# EAGLE design ESP07_TempSensor (EAGLE 6.6.0)
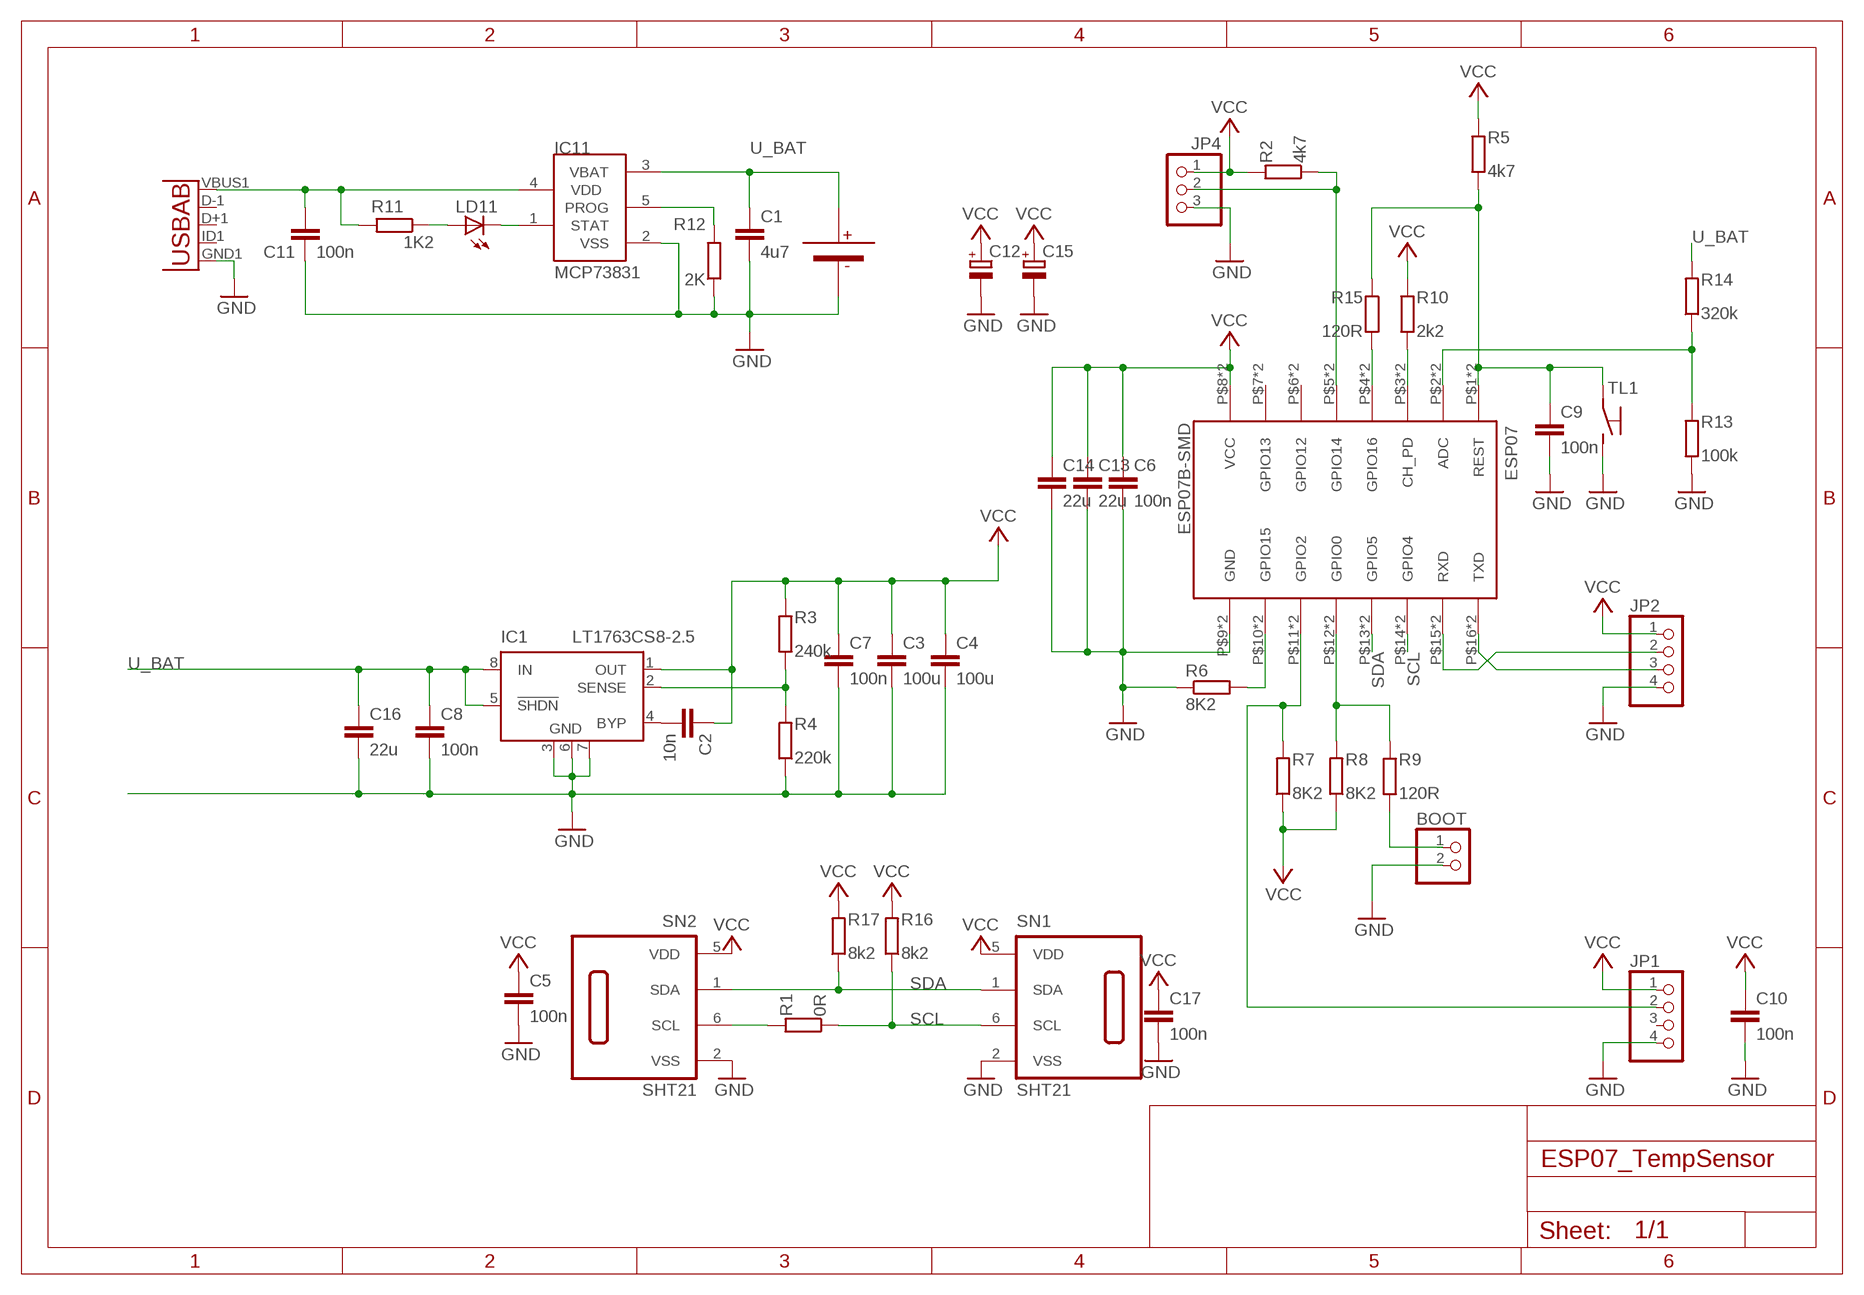
[diagram p0: schematic, sheet 1]

## Parts
BOOT  PINHD-1X2  [1X02]
C1  4u7  C-EUC0805  [C0805]
C2  10n  C-EUC0805  [C0805]
C3  100u  C-EUC1206  [C1206]
C4  100u  C-EUC1206  [C1206]
C5  100n  C-EUC0805  [C0805]
C6  100n  C-EUC0805  [C0805]
C7  100n  C-EUC1206  [C1206]
C8  100n  C-EUC0805  [C0805]
C9  100n  C-EUC0805  [C0805]
C10  100n  C-EUC0805  [C0805]
C11  100n  C-EUC0805  [C0805]
C12  CPOL-EUSMCC  [SMC_C]
C13  22u  C-EUC0805  [C0805]
C14  22u  C-EUC0805  [C0805]
C15  CPOL-EUSMCC  [SMC_C]
C16  22u  C-EUC0805  [C0805]
C17  100n  C-EUC0805  [C0805]
ESP07  ESP07B-SMD  [ESP07]
IC1  LT1763CS8-2.5  [SOIC8]
IC11  MCP73831  [SOT23-5L]
JP1  PINHD-1X4  [1X04]
JP2  PINHD-1X4  [1X04]
JP4  PINHD-1X3  [1X03]
LD11  LEDCHIPLED_0805  [CHIPLED_0805]
R1  0R  R-EU_M0805  [M0805]
R2  4k7  R-EU_M0805  [M0805]
R3  240k  R-EU_M0805  [M0805]
R4  220k  R-EU_M0805  [M0805]
R5  4k7  R-EU_M0805  [M0805]
R6  8K2  R-EU_M0805  [M0805]
R7  8K2  R-EU_M0805  [M0805]
R8  8K2  R-EU_M0805  [M0805]
R9  120R  R-EU_M0805  [M0805]
R10  2k2  R-EU_M0805  [M0805]
R11  1K2  R-EU_M0805  [M0805]
R12  2K  R-EU_M0805  [M0805]
R13  100k  R-EU_M0805  [M0805]
R14  320k  R-EU_M0805  [M0805]
R15  120R  R-EU_M0805  [M0805]
R16  8k2  R-EU_M0805  [M0805]
R17  8k2  R-EU_M0805  [M0805]
SN1  SHT21  [DFN6/SHT]
SN2  SHT21  [DFN6/SHT]
TL1  TS1107GS  [TS1107GS]
U1  USB""  [USB-MICRO-SMD]
U$2  18650_CLIPS  [CLIPS_18650]

## Nets
FB: IC1.2(SENSE) R3.1 R4.2
GND: BOOT.2 C1.2 C3.2 C4.2 C5.2 C6.2 C7.2 C8.2 C9.2 C10.2 C11.1 C12.- C13.2 C14.2 C15.- C16.2 C17.2 ESP07.P9(GND) ESP07.P$9(GND) IC1.3(GND) IC1.6(GND) IC1.7(GND) IC11.2(VSS) JP1.4 JP2.4 JP4.3 R4.1 R6.1 R12.1 R13.1 SN1.2(VSS) SN2.2(VSS) TL1.P$2(S) U1.GND1(GND) U$2.P$3 U$2.P$4
N$1: C2.2 IC1.4(BYP)
N$2: IC11.1(STAT) LD11.C
N$3: ESP07.P5(GPIO14) ESP07.P$5(GPIO14) JP4.2 R2.1
N$4: LD11.A R11.1
N$5: ESP07.P10(GPIO15) ESP07.P$10(GPIO15) R6.2
N$6: R1.2 SN2.6(SCL)
N$8: ESP07.P12(GPIO0) ESP07.P$12(GPIO0) R8.2 R9.1
N$9: IC11.5(PROG) R12.2
N$10: ESP07.P3(CH_PD) ESP07.P$3(CH_PD) R10.1
N$12: BOOT.1 R9.2
N$16: ESP07.P2(ADC) ESP07.P$2(ADC) R13.2 R14.1
N$20: ESP07.P4(GPIO16) ESP07.P$4(GPIO16) R15.2
N$21: C9.1 ESP07.P1(REST) ESP07.P$1(REST) R5.1 R15.1 TL1.P$1(P)
RXD: ESP07.P15(RXD) ESP07.P$15(RXD) JP2.2
SCL: ESP07.P14(GPIO4) ESP07.P$14(GPIO4) R1.1 R16.1 SN1.6(SCL)
SDA: ESP07.P13(GPIO5) ESP07.P$13(GPIO5) R17.1 SN1.1(SDA) SN2.1(SDA)
TMP_DATA: ESP07.P11(GPIO2) ESP07.P$11(GPIO2) JP1.2 R7.2
TXD: ESP07.P16(TXD) ESP07.P$16(TXD) JP2.3
U_BAT: C1.1 C8.1 C16.1 IC1.5(!SHDN) IC1.8(IN) IC11.3(VBAT) R14.2 U$2.P$1 U$2.P$2
U_CHRG: C11.2 IC11.4(VDD) R11.2 U1.VBUS1(VBUS)
VCC: C2.1 C3.1 C4.1 C5.1 C6.1 C7.1 C10.1 C12.+ C13.1 C14.1 C15.+ C17.1 ESP07.P8(VCC) ESP07.P$8(VCC) IC1.1(OUT) JP1.1 JP2.1 JP4.1 R2.2 R3.2 R5.2 R7.1 R8.1 R10.2 R16.2 R17.2 SN1.5(VDD) SN2.5(VDD)
Unconnected: ESP07.P6(GPIO12) ESP07.P7(GPIO13) ESP07.P$6(GPIO12) ESP07.P$7(GPIO13) JP1.3 U1.D+1(D+) U1.D-1(D-) U1.ID1(USBID)

## Library data of the parts
BOOT = pinhead:PINHD-1X2: PIN HEADER
C1 C2 C5 C6 C8-C11 C13 C14 C16 C17 = rcl:C-EU: CAPACITOR, European symbol
C3 C4 C7 = rcl:C-EU: CAPACITOR, European symbol; TME: GRM31CR60J107ME39L
C12 C15 = rcl:CPOL-EU: POLARIZED CAPACITOR, European symbol
ESP07 = NicShackle:ESP07
IC1 = linear-technology:LT1763CS8: 500mA, Low Noise, LDO Micropower Regulators Source: http://cds.linear.com/docs/Datasheet/1763ff.pdf; MPN: LT1763CS8-2.5; OC_FARNELL: 1273616; OC_NEWARK: 57M6051
IC11 = microchip-update-2:MCP73831: Miniature Single-Cell, Fully Integrated Li-Ion, Li-Polymer Charge Management Controllers
JP1 JP2 = pinhead:PINHD-1X4: PIN HEADER
JP4 = pinhead:PINHD-1X3: PIN HEADER
LD11 = led:LED: LED OSRAM: - CHIPLED LG R971, LG N971, LY N971, LG Q971, LY Q971, LO R971, LY R971 LH N974, LH R974 LS Q976, LO Q976, LY Q976 LO Q996 - Hyper CHIPLED LW Q18S LB Q993, LB Q99A, LB R99A - SideLED LS A670, LO A670, LY A670, LG A670, LP A670 LB A673, LV A673, LT A673, LW A673 LH A674 LY A675 LS A676, LA A676, LO A676, LY A676, LW A676 LS A679, LY A679, LG A679 - Hyper Micro SIDELED® LS Y876, LA Y876, LO Y876, LY Y876 LT Y87S - SmartLED LW L88C, LW L88S LB L89C, LB L89S, LG L890 LS L89K, LO L89K, LY L89K LS L896, LA L896, LO L896, LY L896 - TOPLED LS T670, LO T670, LY T670, LG T670, LP T670 LSG T670, LSP T670, LSY T670, LOP T670, LYG T670 LG T671, LOG T671, LSG T671 LB T673, LV T673, LT T673, LW T673 LH T674 LS T676, LA T676, LO T676, LY T676, LB T676, LH T676, LSB T676, LW T676 LB T67C, LV T67C, LT T67C, LS T67K, LO T67K, LY T67K, LW E67C LS E67B, LA E67B, LO E67B, LY E67B, LB E67C, LV E67C, LT E67C LW T67C LS T679, LY T679, LG T679 LS T770, LO T770, LY T770, LG T770, LP T770 LB T773, LV T773, LT T773, LW T773 LH T774 LS E675, LA E675, LY E675, LS T675 LS T776, LA T776, LO T776, LY T776, LB T776 LHGB T686 LT T68C, LB T68C - Hyper Mini TOPLED® LB M676 - Mini TOPLED Santana® LG M470 LS M47K, LO M47K, LY M47K Source: http://www.osram.convergy.de LUXEON: - LUMILED® LXK2-PW12-R00, LXK2-PW12-S00, LXK2-PW14-U00, LXK2-PW14-V00 LXK2-PM12-R00, LXK2-PM12-S00, LXK2-PM14-U00 LXK2-PE12-Q00, LXK2-PE12-R00, LXK2-PE12-S00, LXK2-PE14-T00, LXK2-PE14-U00 LXK2-PB12-K00, LXK2-PB12-L00, LXK2-PB12-M00, LXK2-PB14-N00, LXK2-PB14-P00, LXK2-PB14-Q00 LXK2-PR12-L00, LXK2-PR12-M00, LXK2-PR14-Q00, LXK2-PR14-R00 LXK2-PD12-Q00, LXK2-PD12-R00, LXK2-PD12-S00 LXK2-PH12-R00, LXK2-PH12-S00 LXK2-PL12-P00, LXK2-PL12-Q00, LXK2-PL12-R00 Source: www.luxeon.com KINGBRIGHT: KA-3528ASYC Source: www.kingbright.com
R1-R17 = rcl:R-EU_: RESISTOR, European symbol
SN1 SN2 = sensirion:SHT21: Humidity and Temperature Sensor
TL1 = switchs:TS1107GS
U1 = MicroUSB:USB: This is a USB AB connector that is compatible with USB OTG. i.e. this connector can serve as a host or device
U$2 = Battery_Clips:18650_CLIPS

## Board
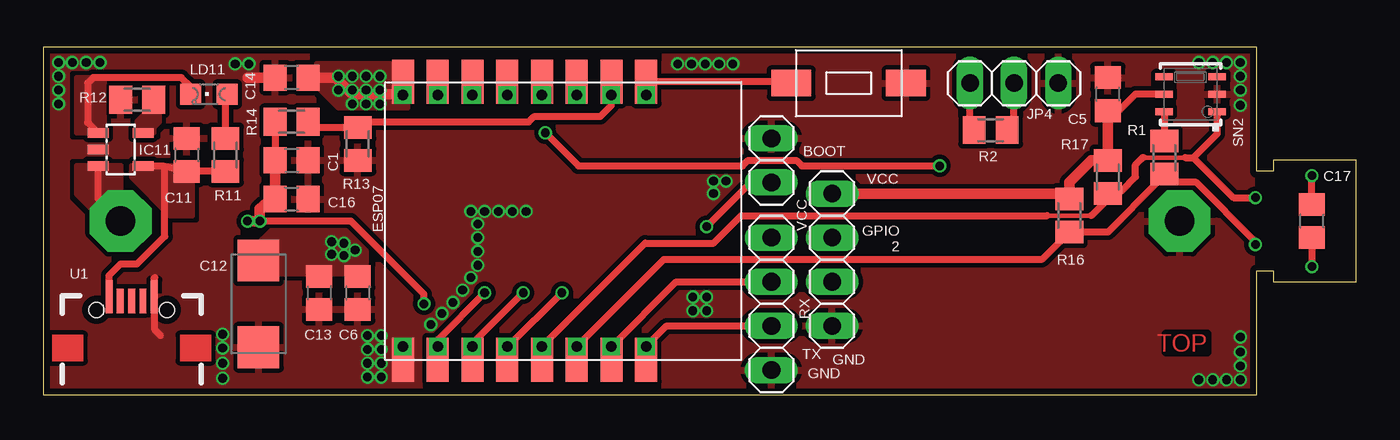
[diagram p1: board, top side]
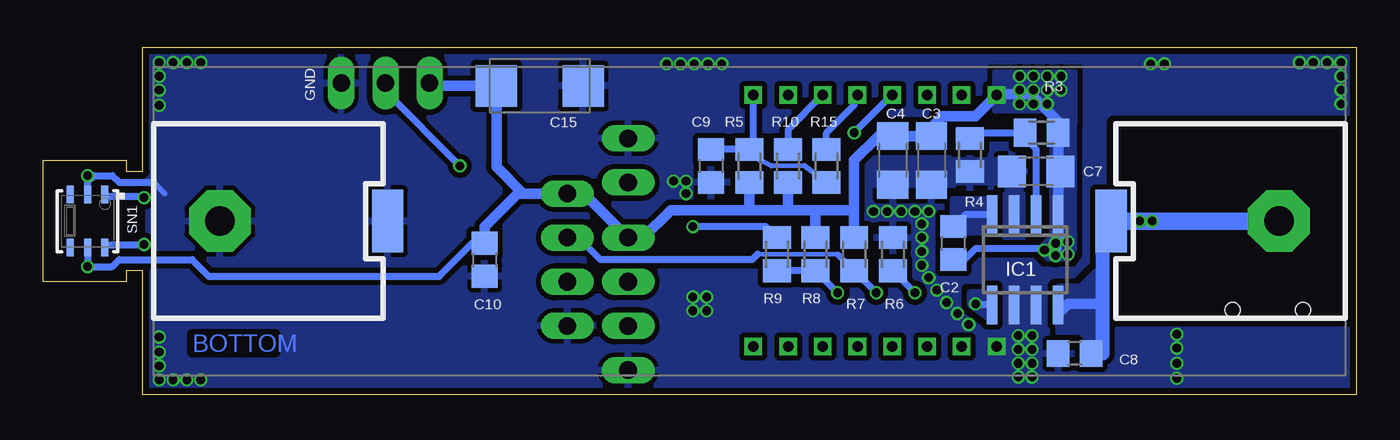
[diagram p2: board, bottom side, seen from below]

Size 75.56 x 19.99 mm. Coordinates in mm from the lower left corner, seen from the top.
Outline: 0,0 69.84,0 69.85,7.14 70.8,7.14 70.8,6.51 75.56,6.51 75.56,13.49 70.8,13.49 70.8,12.86 69.84,12.86 69.84,19.99 0,19.99 0,0
Copper layers (1*16): Top 0.035559375mm / dielectric 1.6mm / Bottom 0.035559375mm
Design rules "oshpark-2layer": minimum track width 6mil, minimum drill 10mil, track to track 6mil, track to pad 6mil, pad to pad 6mil, via to via 6mil, smd to smd 6mil, copper to edge 15mil, drill to drill 6mil, minimum pad ring 5mil, minimum via ring 5mil, stop-mask expansion 2.5mil, vias tented up to drill 0mil, thermal gap 10mil

### Footprints (pad centres in the part's own frame; a part is rotated, then mirrored left to right if it is on the bottom)
1X02 = drill 1.016 long: 1 -1.27,0; 2 1.27,0
C0805 = smd 1.3 x 1.5: 1 -0.95,0; 2 0.95,0
C1206 = smd 1.6 x 1.8: 1 -1.4,0; 2 1.4,0
SMC_C = smd 2.4 x 2.4: + -2.5,0; - 2.5,0
ESP07 = smd 2.54 x 1.27: P1 -8.028,8.027; P2 -8.028,6.027; P3 -8.028,4.027; P4 -8.028,2.027; P5 -8.028,0.027; P6 -8.028,-1.973; P7 -8.028,-3.973; P8 -8.028,-5.973; P9 7.972,-5.973; P10 7.972,-3.973; P11 7.972,-1.973; P12 7.972,0.027; P13 7.972,2.027; P14 7.972,4.027; P15 7.972,6.027; P16 7.972,8.027 | drill 0.6 pad 1.016 square: P$1 -7.264,8.026; P$2 -7.264,6.02; P$3 -7.264,4.039; P$4 -7.264,2.032; P$5 -7.264,0.025; P$6 -7.264,-1.981; P$7 -7.264,-3.962; P$8 -7.264,-5.969; P$9 7.214,-5.969; P$10 7.214,-3.962; P$11 7.214,-1.981; P$12 7.214,0.025; P$13 7.214,2.032; P$14 7.214,4.039; P$15 7.214,6.02; P$16 7.214,8.026
SOIC8 = smd 0.6 x 2.2: 1 -1.905,-2.6; 2 -0.635,-2.6; 3 0.635,-2.6; 4 1.905,-2.6; 5 1.905,2.6; 6 0.635,2.6; 7 -0.635,2.6; 8 -1.905,2.6
SOT23-5L = smd 0.55 x 1.2: 1 -0.95,-1.3; 2 0,-1.3; 3 0.95,-1.3; 4 0.95,1.3; 5 -0.95,1.3
1X04 = drill 1.016 long: 1 -3.81,0; 2 -1.27,0; 3 1.27,0; 4 3.81,0
1X03 = drill 1.016 long: 1 -2.54,0; 2 0,0; 3 2.54,0
CHIPLED_0805 = smd 1.2 x 1.2: A 0,-1.05; C 0,1.05
M0805 = smd 1.3 x 1.6: 1 -0.95,0; 2 0.95,0
DFN6/SHT = smd 0.4 x 1: 1 -1,-1.527; 2 0,-1.527; 3 1,-1.527; 4 1,1.527; 5 0,1.527; 6 -1,1.527
TS1107GS = smd 2.286 x 1.524: P$1 -3.302,0; P$2 3.302,0
USB-MICRO-SMD = smd 1.4 x 0.4: D+1 2.7,0; D-1 2.7,0.65; ID1 2.7,-0.65 | smd 1.908 x 0.4: GND1 2.954,-1.3; VBUS1 2.954,1.3 | hole 0.85: 2.2,2.027; 2.2,-2.027
CLIPS_18650 = drill 1.7 pad 3.556 octagon: P$1 0,0; P$3 60.96,0 | smd 1.8 x 3.6: P$2 9.652,0; P$4 51.308,0

### Placement (x,y rotation side)
BOOT  41.91,13.49 90 top
C1  14.29,13.49 0 top
C2  23.18,8.73 90 bottom
C3  24.45,13.49 270 bottom
C4  26.67,13.49 270 bottom
C5  61.28,17.3 90 top
C6  18.1,5.87 270 top
C7  18.41,12.86 180 bottom
C8  16.19,2.38 180 bottom
C9  37.15,13.18 270 bottom
C10  50.16,7.78 270 bottom
C11  8.26,13.81 270 top
C12  12.38,5.24 270 top
C13  15.88,5.87 270 top
C14  14.29,18.26 180 top
C15  46.99,17.78 0 bottom
C16  14.29,11.27 0 top
C17  73.03,10 90 top
ESP07  26.67,10 270 top
IC1  19.05,7.78 180 bottom
IC11  4.45,14.13 270 top
JP1  45.4,7.78 270 top
JP2  41.91,5.24 270 top
JP4  55.88,17.94 0 top
LD11  9.53,17.3 90 top
R1  64.53,13.65 90 top
R2  54.53,15.24 180 top
R3  18.1,15.08 0 bottom
R4  22.23,13.81 90 bottom
R5  34.92,13.18 270 bottom
R6  26.67,8.1 270 bottom
R7  28.89,8.1 270 bottom
R8  31.11,8.1 270 bottom
R9  33.34,8.1 90 bottom
R10  32.7,13.18 270 bottom
R11  10.48,13.81 270 top
R12  5.4,16.99 0 top
R13  18.1,14.45 90 top
R14  14.29,15.72 180 top
R15  30.48,13.18 90 bottom
R16  59.05,10.32 90 top
R17  61.28,12.54 90 top
SN1  73.03,10 180 bottom
SN2  66.04,17.3 90 top
TL1  46.35,17.94 0 top
U1  5.08,2.7 90 top
U$2  4.45,10 180 bottom

### Tracks (layer width: path | path; a pad name or v marks a point on that pad's centre or on a via)
FB
  Bottom 0.406: R4.2 21.91,15.08 R3.1 19.05,14.76 18.41,14.13 IC1.2
GND  (via drill 0.5)
  Top 0.406: 6.75,3.41 6.38,3.78 U1.GND1 6.37,5.72 6.37,6.69 6.43,6.75 | C17.2 v73.03,12.62
  Top 0.61: C14.2 11.75,18.26
  Bottom 0.305: SN1.2 73.03,11.91 | 69.22,12.22 68.58,11.59
  Bottom 0.406: 73.03,11.91 v73.03,12.62 72.95,12.38 72.63,12.62 71.6,12.62 71.2,12.22 69.22,12.22
  other vias: 68.9,0.87 68.9,18.34 68.9,1.67 68.9,2.46 68.9,17.54 68.9,16.67 68.9,19.13 68.9,3.33 19.45,3.41 18.65,3.41 18.65,2.62 19.45,2.62 19.45,1.83 18.65,1.83 19.45,1.03 18.65,1.03 22.3,4.05 22.94,4.68 23.57,5.32 0.87,19.13 1.67,19.13 0.87,18.34 2.46,19.13 0.87,17.54 0.87,16.75 3.25,19.13 10.32,0.95 10.32,1.83 10.32,2.7 10.32,3.49 68.1,19.13 67.31,19.13 66.52,19.13 68.1,0.87 67.31,0.87 66.52,0.87 37.39,5.64 37.39,4.84 38.18,4.84 38.18,5.64 36.51,19.05 37.31,19.05 38.1,19.05 38.89,19.05 39.69,19.05 11.83,19.05 11.03,19.05 24.61,10.56 25.4,10.56 26.19,10.56 26.99,10.56 27.78,10.56 25,9.84 25,9.05 25,8.26 25,7.46 24.61,6.75 24.13,6.03 38.58,12.3 38.58,11.59 39.29,12.3
  pour Top (isolate 0.254, rank 6): 0.32,19.68 69.53,19.68 69.53,0.32 0.32,0.32
  pour Bottom (isolate 0.305, rank 6): 0.32,19.68 69.53,19.68 69.53,0.32 0.32,0.32
  pour Bottom (no thermals): 20,11.59 20,11.91 20.32,12.22 27.94,12.22 27.94,13.18 27.62,13.49 19.68,13.49 19.37,13.18 19.37,11.59
N$1
  Bottom 0.406: IC1.4 22.48,10.38 C2.2
  pour Bottom (no thermals): 21.27,9.37 23.18,9.37 23.18,11.27 21.27,11.27
N$2
  Top 0.406: LD11.C 8.47,17.72 7.94,18.26 2.86,18.26 2.54,17.94 2.54,15.68 IC11.1
  pour Top (no thermals): 3.49,15.08 3.49,18.26 1.91,18.26 1.91,15.08
N$3  (via drill 0.5)
  Top 0.406: v28.89,15.08 30.8,13.18 40.24,13.18 40.56,13.49 43.34,13.49 43.66,13.18 v51.59,13.18 | ESP07.P5 ESP07.P$5 | R2.1 55.88,15.64 JP4.2
  Bottom 0.406: ESP07.P$5 v28.89,15.08 | v51.59,13.18 55.88,17.46 JP4.2
N$4
  Top 0.406: R11.1 10.48,17.08 LD11.A
N$5  (via drill 0.5)
  Top 0.406: v25.4,5.87 22.71,3.18 ESP07.P$10 22.7,2.78 ESP07.P10
  Bottom 0.406: v25.4,5.87 v25.4,5.88 R6.2
N$6
  Top 0.406: SN2.6 64.53,16.3 R1.2
N$8  (via drill 0.5)
  Top 0.406: ESP07.P12 ESP07.P$12 | ESP07.P$12 | ESP07.P$12 26.76,2.79 v29.84,5.87
  Bottom 0.406: v29.84,5.87 v29.84,5.88 R8.2 R9.1
N$9
  pour Top (no thermals): 5.4,15.08 5.4,15.72 6.03,16.35 6.67,16.35 6.67,15.72 6.35,15.4 6.35,15.08
N$10
  Top 0.406: ESP07.P3 30.71,18.02 ESP07.P$3
  Bottom 0.406: ESP07.P$3 32.7,15.27 R10.1
N$12  (via drill 0.5)
  Top 0.406: v38.18,9.68 40.72,12.22 BOOT.1
  Bottom 0.406: R9.2 33.98,9.68 v38.18,9.68
N$16
  Top 0.406: R14.1 15.56,15.4 R13.2 18.42,15.72 27.94,15.72 28.26,16.03 32.07,16.03 32.69,16.66 ESP07.P$2 ESP07.P2
N$20
  Top 0.406: ESP07.P4 ESP07.P$4
  Bottom 0.406: R15.2 30.48,15.08 28.89,16.67 28.89,17.07 ESP07.P$4
N$21
  Top 0.406: ESP07.P$1 ESP07.P1 43.05,18.03 TL1.P$1
  Bottom 0.254: 33.66,13.18 31.75,13.18
  Bottom 0.305: 33.66,13.18 34.29,13.49 R5.1 | 31.75,13.18 R15.1
  Bottom 0.406: R5.1 35.01,14.36 | 35.01,14.36 34.7,14.67 ESP07.P$1 | 35.01,14.36 35.24,14.13 C9.1
RXD
  Top 0.406: ESP07.P15 ESP07.P$15 | ESP07.P$15 | ESP07.P$15 36.42,6.51 JP2.2
SCL  (via drill 0.5)
  Top 0.406: 64.14,12.22 66.36,12.22 69.77,8.81 v69.77,8.65 | ESP07.P14 30.7,2.78 ESP07.P$14 35.7,7.78 57.47,7.78 R16.1 61.28,9.37 64.14,12.22 | 64.14,12.22 64.14,12.31 R1.1
  Bottom 0.305: 69.82,8.6 v69.77,8.65
  Bottom 0.406: 69.82,8.6 71.9,8.6 SN1.6
SDA  (via drill 0.5)
  Top 0.254: 57.78,10.32 60.33,10.32 | 63.34,13.65 65.72,13.65
  Top 0.406: ESP07.P$13 34.65,8.73 38.58,8.73 40.16,10.32 57.78,10.32 | 60.33,10.32 61.28,11.27 R17.1 61.35,11.75 62.07,11.75 62.87,12.54 62.87,13.26 63.26,13.65 63.34,13.65 | 65.72,13.65 66.2,13.65 | 66.2,13.65 68.5,11.35 v69.77,11.35 | 66.2,13.65 67.57,15.02 SN2.1
  Top 0.61: ESP07.P13 ESP07.P$13
  Bottom 0.305: 69.82,11.4 v69.77,11.35
  Bottom 0.406: 69.82,11.4 71.9,11.4 SN1.1
TMP_DATA  (via drill 0.5)
  Top 0.406: v27.62,5.87 24.69,2.94 ESP07.P$11 24.7,2.78 ESP07.P11
  Bottom 0.254: 29.84,8.1 34.45,8.1
  Bottom 0.305: R7.2 29.84,8.1
  Bottom 0.406: v27.62,5.87 v27.62,5.88 R7.2 | 34.45,8.1 34.77,7.78 43.5,7.78 44.77,9.05 JP1.2
TXD
  Top 0.406: ESP07.P16 ESP07.P$16 | ESP07.P$16 | ESP07.P$16 35.88,3.97 JP2.3
U_BAT  (via drill 0.5)
  Top 0.406: U$2.P$1 3.15,11.3 IC11.3 | R14.2 C1.1 | v21.91,5.24 21.91,5.79 17.7,10 v12.46,10
  Top 0.61: C1.1 C16.1 13.34,10.96 13.65,10.96 13.65,10.95 12.7,10.95 12.46,10.72 v12.46,10 v11.75,10
  Bottom 0.406: IC1.5 21.53,5.18 v21.91,5.24
  Bottom 0.61: U$2.P$2 14.61,8.22 | 14.61,2.38 C8.1 | 14.61,5.24 16.57,5.24 16.89,4.92 IC1.8
  Bottom 0.813: 14.61,8.22 14.61,5.24 14.61,3.02 14.61,2.38
  Bottom 1.016: U$2.P$1 v11.75,10 U$2.P$2
  pour Bottom (no thermals): 14.92,7.14 15.88,6.19 17.14,6.19 17.14,3.65 15.88,3.65 14.92,2.7
  pour Bottom (no thermals): 20.95,5.87 22.23,5.87 22.23,5.24 20.95,4.29
  pour Top (no thermals): 1.91,13.18 4.45,13.18 4.45,10 3.49,10 1.91,11.59
U_CHRG
  Top 0.406: IC11.4 6.91,13.18 | 6.91,13.18 C11.2 R11.2 | U1.VBUS1 3.78,6.88 4.45,7.54 5.4,7.54 6.99,9.13 6.99,13.1 6.91,13.18
  pour Top (no thermals): 5.08,13.18 8.57,13.18 8.57,10.32 7.3,10.32 5.08,12.54
VCC  (via drill 0.5)
  Top 0.406: ESP07.P8 ESP07.P$8 | R16.2 59.05,11.59 | 60.96,13.49 R17.2 | SN2.5 62.87,17.3 61.91,16.35 C5.1 | C17.1 v73.03,7.38 | R2.2 53.34,15.48 JP4.1
  Top 0.61: 20.47,18.26 ESP07.P8 | JP1.1 59.05,11.59 59.05,12.22 60.33,13.49 R17.2 C5.1 | C14.1 16.83,18.26 17.78,17.3 20.66,17.3 ESP07.P$8
  Bottom 0.406: IC1.1 17.14,9.37 17.14,9.05 17.78,8.41 21.91,8.41 22.54,7.78 22.86,7.78 C2.1 | C10.1 50.88,8.73 52.78,6.83 66.04,6.83 66.99,7.78 71.2,7.78 71.6,7.38 v73.03,7.38 SN1.5
  Bottom 0.61: IC1.1 17.14,12.73 C7.1 17.15,12.99 R3.2 | 17.02,14.95 R3.2 | C4.1 C3.1 24.45,15.4 23.81,16.03 21.91,16.03 20.7,17.24 ESP07.P$8 20.66,17.3 18.73,17.3 17.15,15.72 R3.2 | 26.8,14.45 C4.1 | 28.89,10.64 28.89,13.49 27.49,14.89 C4.1 | 28.89,10.64 31.11,10.64 | 31.11,10.64 32.7,10.64 | 32.7,10.64 34.92,10.64 | 34.92,10.64 39.45,10.64 41.04,9.05 JP2.1 44.45,11.59 JP1.1 | R7.1 28.89,10.64 | R8.1 31.11,10.64 | R10.2 32.7,10.64 | R5.2 34.92,10.64 | 46.67,11.59 JP1.1 | JP1.1 47.94,11.59 | 47.94,11.59 48.26,11.59 50.16,9.68 C10.1 | v17.3,8.02 17.14,9.37 | JP4.1 53.18,17.78 C15.+ 49.49,13.14 47.94,11.59
  other vias: 19.37,18.34 19.37,17.54 19.37,16.75 18.57,18.34 18.57,17.54 18.57,16.75 17.78,18.34 17.78,17.54 17.78,16.75 16.99,18.34 16.99,17.54 16.59,8.81 17.3,8.73 16.59,8.1 17.94,8.33
  pour Bottom (no thermals): 17.7,7.86 18.1,8.26 18.1,8.49 17.46,9.13 17.46,15.72 16.27,15.72 16.27,8.33 16.59,7.86
  pour Top (no thermals): 20.95,19.05 15.72,19.05 15.72,17.78 16.99,16.51 20.95,16.51
  pour Bottom (no thermals): 17.62,15.72 17.62,16.35 20.8,16.35 20.8,18.57 16.19,18.57 16.19,15.72
  pour Top (no thermals): 18.57,6.99 18.57,8.26 17.38,9.45 13.1,9.45 12.22,8.57 12.22,6.99

### Text on the board
Top: TOP
Bottom: BOTTOM
tNames: VCC | VCC | GPIO / 2 | RX | TX | GND | GND
bNames: GND
bDocu: + | - | - | +